# Altium schematic sheet hsi_filters.SchDoc
size A4; PageSetup: Record=PageOptions|CenterHorizontal=True|CenterVertical=True|PrintScale=0.91|XCorrection=1.00|YCorrection=1.00|PrintKind=1|BorderSize=5000000|LeftOffset=0|BottomOffset=0|Orientation=2|PaperLength=1000|PaperWidth=1000|Scale=100|PaperSource=15|PrintQuality=1200|MediaType=1|DitherType=10|PaperKind=Letter|PrintScaleMode=1
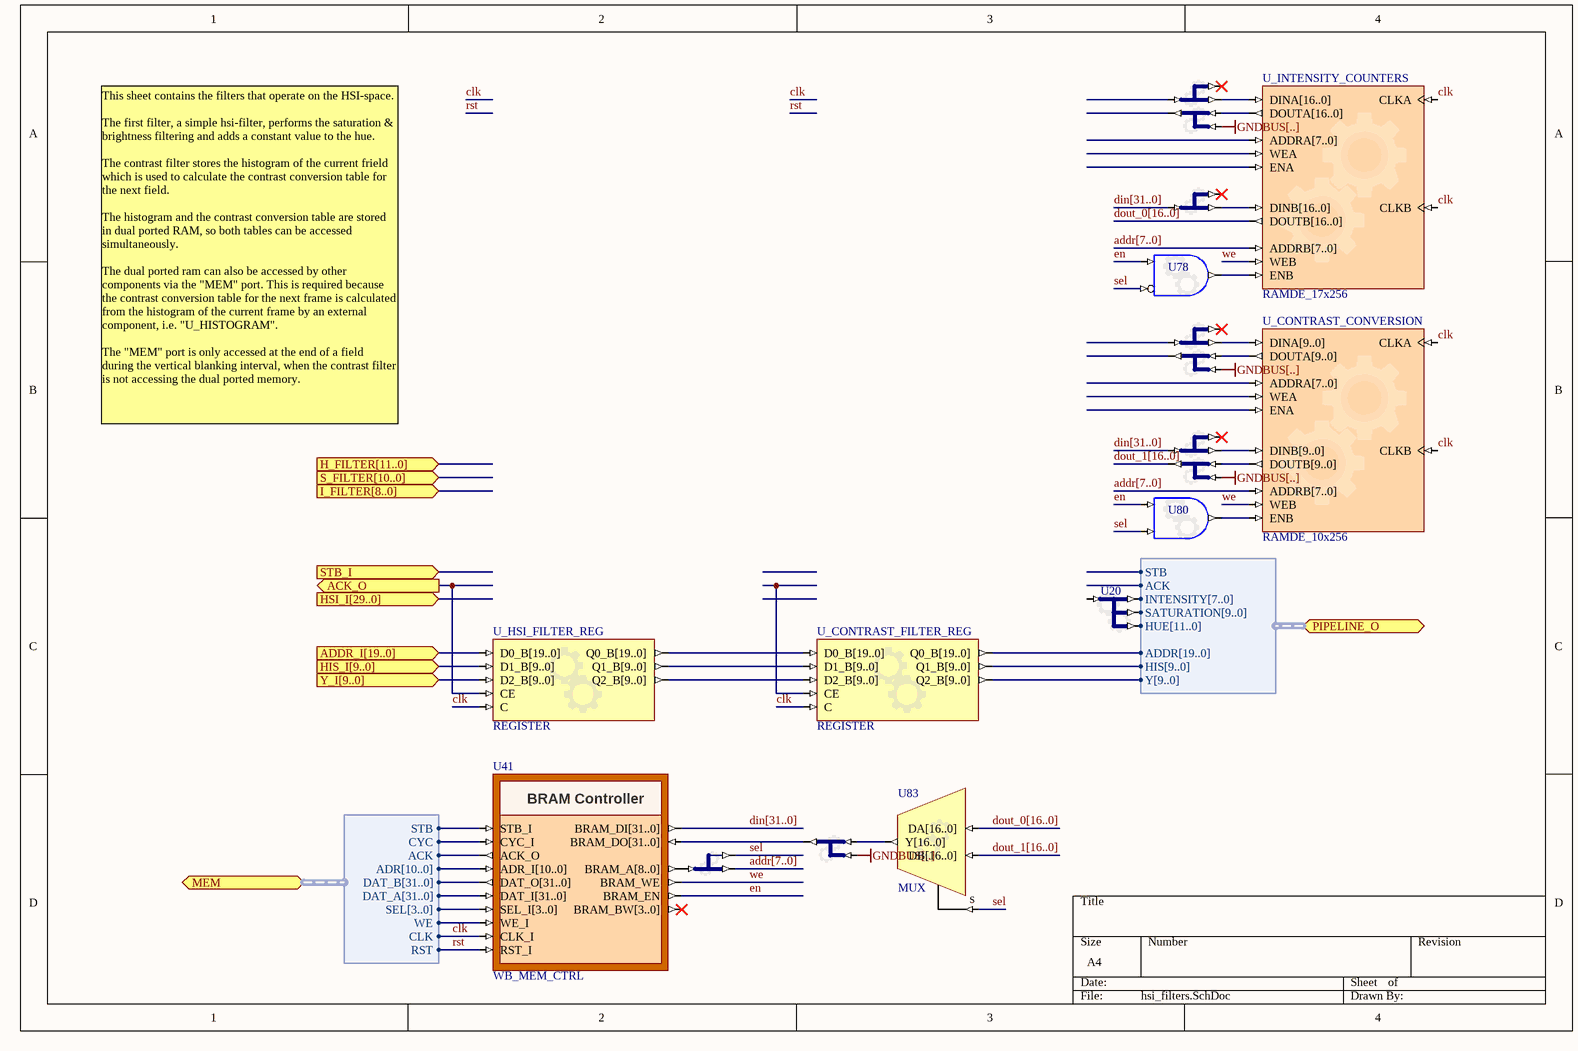
[diagram p0: hsi_filters.SchDoc]

## Parts
U1  BUS_JS  (value not drawn)
U16  BUS_JS  (value not drawn)
U17  BUS_JS  (value not drawn)
U20  BUS_JS  (value not drawn)
U41  WB_MEM_CTRL
U44  BUS_JS  (value not drawn)
U55  BUS_JS  (value not drawn)
U56  BUS_JS  (value not drawn)
U63  BUS_JS  (value not drawn)
U73  BUS_JS  (value not drawn)
U78  AND2S  (value not drawn)
U80  AND2S  (value not drawn)
U81  BUS_JS  (value not drawn)
U83  MUX
U_CONTRAST_CONVERSION  RAMDE_10x256
U_CONTRAST_FILTER_REG  REGISTER
U_HSI_FILTER_REG  REGISTER
U_INTENSITY_COUNTERS  RAMDE_17x256

## Ports
ACK_O (out), ADDR_I[19..0] (in), H_FILTER[11..0] (in), HIS_I[9..0] (in), HSI_I[29..0] (in), I_FILTER[8..0] (in), MEM (harness WB_A11DAB32S), PIPELINE_O (harness H_PIXEL_PIPELINE_1_5), S_FILTER[10..0] (in), STB_I (in), Y_I[9..0] (in)

## Harnesses
WB_A11DAB32S: STB, CYC, ACK, ADR[10..0], DAT_A[31..0], DAT_B[31..0], SEL[3..0], WE, CLK, RST
H_PIXEL_PIPELINE_1_5: ADDR[19..0], Y[9..0], HIS[9..0], STB, ACK, HUE[11..0], SATURATION[9..0], INTENSITY[7..0]

## Nets
GNDBUS[..]: U17.I1_B[14..0] U56.I1_B[14..0] U73.I1_B[5..0] U81.I1_B[6..0]
ACK_O: U_HSI_FILTER_REG.CE ; port ACK_O
addr[7..0]: U44.O0_B[7..0] U_CONTRAST_CONVERSION.ADDRB[7..0] U_INTENSITY_COUNTERS.ADDRB[7..0]
ADDR_I[19..0]: U_HSI_FILTER_REG.D0_B[19..0] ; port ADDR_I[19..0]
clk: U41.CLK_I U_CONTRAST_CONVERSION.CLKA U_CONTRAST_CONVERSION.CLKB U_CONTRAST_FILTER_REG.C U_HSI_FILTER_REG.C U_INTENSITY_COUNTERS.CLKA U_INTENSITY_COUNTERS.CLKB ; port MEM.CLK
din[31..0]: U1.I[31..0] U16.I[31..0] U41.BRAM_DI[31..0]
dout_0[16..0]: U83.DA[16..0] U_INTENSITY_COUNTERS.DOUTB[16..0]
dout_1[16..0]: U81.O[16..0] U83.DB[16..0]
en: U41.BRAM_EN U78.I0 U80.I0
HIS_I[9..0]: U_HSI_FILTER_REG.D1_B[9..0] ; port HIS_I[9..0]
rst: U41.RST_I ; port MEM.RST
sel: U44.O1 U78.I1 U80.I1 U83.S
we: U41.BRAM_WE U_CONTRAST_CONVERSION.WEB U_INTENSITY_COUNTERS.WEB
Y_I[9..0]: U_HSI_FILTER_REG.D2_B[9..0] ; port Y_I[9..0]
NetU1_O0_B[16..0]: U1.O0_B[16..0] U_INTENSITY_COUNTERS.DINB[16..0]
NetU16_O0_B[9..0]: U16.O0_B[9..0] U_CONTRAST_CONVERSION.DINB[9..0]
NetU17_I0_B[16..0]: U17.I0_B[16..0] U83.Y[16..0]
NetU17_O[31..0]: U17.O[31..0] U41.BRAM_DO[31..0]
NetU20_O0_B[7..0]: U20.O0_B[7..0] ; port PIPELINE_O.INTENSITY[7..0]
NetU20_O1_B[9..0]: U20.O1_B[9..0] ; port PIPELINE_O.SATURATION[9..0]
NetU20_O2_B[11..0]: U20.O2_B[11..0] ; port PIPELINE_O.HUE[11..0]
NetU41_ACK_O: U41.ACK_O ; port MEM.ACK
NetU41_ADR_I[10..0]: U41.ADR_I[10..0] ; port MEM.ADR[10..0]
NetU41_BRAM_A[8..0]: U41.BRAM_A[8..0] U44.I[8..0]
NetU41_CYC_I: U41.CYC_I ; port MEM.CYC
NetU41_DAT_I[31..0]: U41.DAT_I[31..0] ; port MEM.DAT_A[31..0]
NetU41_DAT_O[31..0]: U41.DAT_O[31..0] ; port MEM.DAT_B[31..0]
NetU41_SEL_I[3..0]: U41.SEL_I[3..0] ; port MEM.SEL[3..0]
NetU41_STB_I: U41.STB_I ; port MEM.STB
NetU41_WE_I: U41.WE_I ; port MEM.WE
NetU55_O0_B[16..0]: U55.O0_B[16..0] U_INTENSITY_COUNTERS.DINA[16..0]
NetU56_I0_B[16..0]: U56.I0_B[16..0] U_INTENSITY_COUNTERS.DOUTA[16..0]
NetU63_O0_B[9..0]: U63.O0_B[9..0] U_CONTRAST_CONVERSION.DINA[9..0]
NetU73_I0_B[9..0]: U73.I0_B[9..0] U_CONTRAST_CONVERSION.DOUTA[9..0]
NetU78_O: U78.O U_INTENSITY_COUNTERS.ENB
NetU80_O: U80.O U_CONTRAST_CONVERSION.ENB
NetU81_I0_B[9..0]: U81.I0_B[9..0] U_CONTRAST_CONVERSION.DOUTB[9..0]
NetU_CONTRAST_FILTER_REG_D0_B[19..0]: U_CONTRAST_FILTER_REG.D0_B[19..0] U_HSI_FILTER_REG.Q0_B[19..0]
NetU_CONTRAST_FILTER_REG_D1_B[9..0]: U_CONTRAST_FILTER_REG.D1_B[9..0] U_HSI_FILTER_REG.Q1_B[9..0]
NetU_CONTRAST_FILTER_REG_D2_B[9..0]: U_CONTRAST_FILTER_REG.D2_B[9..0] U_HSI_FILTER_REG.Q2_B[9..0]
NetU_CONTRAST_FILTER_REG_Q0_B[19..0]: U_CONTRAST_FILTER_REG.Q0_B[19..0] ; port PIPELINE_O.ADDR[19..0]
NetU_CONTRAST_FILTER_REG_Q1_B[9..0]: U_CONTRAST_FILTER_REG.Q1_B[9..0] ; port PIPELINE_O.HIS[9..0]
NetU_CONTRAST_FILTER_REG_Q2_B[9..0]: U_CONTRAST_FILTER_REG.Q2_B[9..0] ; port PIPELINE_O.Y[9..0]

Not connected (* = marked no-connect by the designer): U1 O1_B[14..0]*; U16 O1_B[21..0]*; U20 I[29..0]; U41 BRAM_BW[3..0]*; U55 I[31..0] O1_B[14..0]*; U56 O[31..0]; U63 I[15..0] O1_B[5..0]*; U73 O[15..0]; U_CONTRAST_CONVERSION ADDRA[7..0] ENA WEA; U_CONTRAST_FILTER_REG CE; U_INTENSITY_COUNTERS ADDRA[7..0] ENA WEA

## Buses and harness runs
bus addr[7..0]
bus din[31..0]
bus dout_0[16..0]
bus dout_1[16..0]

## Notes on the sheet
- This sheet contains the filters that operate on the HSI-space.
  The first filter, a simple hsi-filter, performs the saturation & brightness filtering and adds a constant value to the hue.
  The contrast filter stores the histogram of the current frield which is used to calculate the contrast conversion table for the next field.
  The histogram and the contrast conversion table are stored in dual ported RAM, so both tables can be accessed simultaneously.
  The dual ported ram can also be accessed by other components via the "MEM" port. This is required because the contrast conversion table for the next frame is calculated from the histogram of the current frame by an external component, i.e. "U_HISTOGRAM".
  The "MEM" port is only accessed at the end of a field during the vertical blanking interval, when the contrast filter is not accessing the dual ported memory.
- (in symbol WB_MEM_CTRL) BRAM Controller

## Library data of the parts
U1 U55 = BUS_JS: Configurable Bus Joiner/Splitter; ConfiguratorName: GENERIC_BUS_JS; ConfigurationParameters: {}Version[1.1]{}SplitterJoinerType[Splitter]{}SignalCount[2]{}SignalWidth0[17]{}GapBelow0[1000000]{}ConnectionType0[Pin]{}SignalWidth1[15]{}GapBelow1[1000000]{}ConnectionType1[Pin]{}ShowPinNames[False]{}; LastRevisionNo: 1.00.00; Published: 17-Sep-2008; Publisher: Altium Limited; HelpURL: https://wiki.altium.com/display/ADOH/Configurable+Generic+Library
U16 = BUS_JS: Configurable Bus Joiner/Splitter; ConfiguratorName: GENERIC_BUS_JS; ConfigurationParameters: {}Version[1.1]{}SplitterJoinerType[Splitter]{}SignalCount[2]{}SignalWidth0[10]{}GapBelow0[1000000]{}ConnectionType0[Pin]{}SignalWidth1[22]{}GapBelow1[1000000]{}ConnectionType1[Pin]{}ShowPinNames[False]{}; LastRevisionNo: 1.00.00; Published: 17-Sep-2008; Publisher: Altium Limited; HelpURL: https://wiki.altium.com/display/ADOH/Configurable+Generic+Library
U17 U56 = BUS_JS: Configurable Bus Joiner/Splitter; ConfiguratorName: GENERIC_BUS_JS; ConfigurationParameters: {}Version[1.1]{}SplitterJoinerType[Joiner]{}SignalCount[2]{}SignalWidth0[17]{}GapBelow0[1000000]{}ConnectionType0[Pin]{}SignalWidth1[15]{}GapBelow1[1000000]{}ConnectionType1[Pin]{}ShowPinNames[False]{}; LastRevisionNo: 1.00.00; Published: 17-Sep-2008; Publisher: Altium Limited; HelpURL: https://wiki.altium.com/display/ADOH/Configurable+Generic+Library
U20 = BUS_JS: Configurable Bus Joiner/Splitter; ConfiguratorName: GENERIC_BUS_JS; ConfigurationParameters: {}Version[1.1]{}SplitterJoinerType[Splitter]{}SignalCount[3]{}SignalWidth0[8]{}GapBelow0[1000000]{}ConnectionType0[Pin]{}SignalWidth1[10]{}GapBelow1[1000000]{}ConnectionType1[Pin]{}SignalWidth2[12]{}GapBelow2[1000000]{}ConnectionType2[Pin]{}ShowPinNames[False]{}; LastRevisionNo: 1.00.00; Published: 17-Sep-2008; Publisher: Altium Limited; HelpURL: https://wiki.altium.com/display/ADOH/Configurable+Generic+Library
U41 = WB_MEM_CTRL: Configurable Memory Controller; ConfigurationParameters: {}Version[1.0]{}Option_MemoryType[Block RAM]{}Option_MemorySize[2 KB (512 x 32-bit)]{}Option_Layout[1 x 32-bit Wide Device]{}Option_Read[2]{}Option_WriteSetup[1]{}Option_WritePulse[1]{}Option_WriteHold[1]{}Option_FlashRead[4]{}Option_FlashWriteSetup[1]{}Option_FlashWritePulse[5]{}Option_FlashWriteHold[1]{}Option_SdramKeepRowOpen[0]{}Option_SdramClock[100]{}Option_SdramWriteRecovery[4]{}Option_SdramAutoRefresh[16]{}Option_SdramActiveToReadWrite[8]{}Option_SdramPrecharge[16]{}Option_SdramCasLatency[2]{}Option_SdramClockScheme[0]{}; UseInDSF: True; ComponentLink1Description: Core &Resource Usage; ComponentLink1URL: CR0139 FPGA Peripheral Resource Usage.pdf#page=85; HelpURL: https://wiki.altium.com/display/ADOH/WB_MEM_CTRL+-+Configurable+Wishbone+Memory+Controller; LastRevisionNo: 1.00.00; Published: 9-Dec-2004; Publisher: Altium Limited; ConfiguratorName: WB_MEM_CTRL
U44 = BUS_JS: Configurable Bus Joiner/Splitter; ConfiguratorName: GENERIC_BUS_JS; ConfigurationParameters: {}Version[1.1]{}SplitterJoinerType[Splitter]{}SignalCount[2]{}SignalWidth0[8]{}GapBelow0[1000000]{}ConnectionType0[Pin]{}SignalWidth1[1]{}GapBelow1[1000000]{}ConnectionType1[Pin]{}ShowPinNames[False]{}; LastRevisionNo: 1.00.00; Published: 17-Sep-2008; Publisher: Altium Limited; HelpURL: https://wiki.altium.com/display/ADOH/Configurable+Generic+Library
U63 = BUS_JS: Configurable Bus Joiner/Splitter; ConfiguratorName: GENERIC_BUS_JS; ConfigurationParameters: {}Version[1.1]{}SplitterJoinerType[Splitter]{}SignalCount[2]{}SignalWidth0[10]{}GapBelow0[1000000]{}ConnectionType0[Pin]{}SignalWidth1[6]{}GapBelow1[1000000]{}ConnectionType1[Pin]{}ShowPinNames[False]{}; LastRevisionNo: 1.00.00; Published: 17-Sep-2008; Publisher: Altium Limited; HelpURL: https://wiki.altium.com/display/ADOH/Configurable+Generic+Library
U73 = BUS_JS: Configurable Bus Joiner/Splitter; ConfiguratorName: GENERIC_BUS_JS; ConfigurationParameters: {}Version[1.1]{}SplitterJoinerType[Joiner]{}SignalCount[2]{}SignalWidth0[10]{}GapBelow0[1000000]{}ConnectionType0[Pin]{}SignalWidth1[6]{}GapBelow1[1000000]{}ConnectionType1[Pin]{}ShowPinNames[False]{}; LastRevisionNo: 1.00.00; Published: 17-Sep-2008; Publisher: Altium Limited; HelpURL: https://wiki.altium.com/display/ADOH/Configurable+Generic+Library
U78 = GATE: Configurable Generic Gate; ConfiguratorName: GENERIC_GATE; ConfigurationParameters: {}Version[1.1]{}GateKind[AND]{}BusInput[False]{}GateInputType[Bit]{}GateOutputOption[Normal]{}BusWidth[8]{}RegisterOutputs[False]{}NegativeClockEdge[False]{}InputCount[2]{}InputInvert0[False]{}InputInvert1[True]{}; LastRevisionNo: 1.00.00; Published: 3-Sep-2008; Publisher: Altium Limited; HelpURL: https://wiki.altium.com/display/ADOH/Configurable+Generic+Library
U80 = GATE: Configurable Generic Gate; ConfiguratorName: GENERIC_GATE; ConfigurationParameters: {}Version[1.1]{}GateKind[AND]{}BusInput[False]{}GateInputType[Bit]{}GateOutputOption[Normal]{}BusWidth[8]{}RegisterOutputs[False]{}NegativeClockEdge[False]{}InputCount[2]{}InputInvert0[False]{}InputInvert1[False]{}; LastRevisionNo: 1.00.00; Published: 3-Sep-2008; Publisher: Altium Limited; HelpURL: https://wiki.altium.com/display/ADOH/Configurable+Generic+Library
U81 = BUS_JS: Configurable Bus Joiner/Splitter; ConfiguratorName: GENERIC_BUS_JS; ConfigurationParameters: {}Version[1.1]{}SplitterJoinerType[Joiner]{}SignalCount[2]{}SignalWidth0[10]{}GapBelow0[1000000]{}ConnectionType0[Pin]{}SignalWidth1[7]{}GapBelow1[1000000]{}ConnectionType1[Pin]{}ShowPinNames[False]{}; LastRevisionNo: 1.00.00; Published: 17-Sep-2008; Publisher: Altium Limited; HelpURL: https://wiki.altium.com/display/ADOH/Configurable+Generic+Library
U83 = MUX: Configurable Mutliplexer; ConfigurationParameters: {}Version[1.0]{}ShowEnable[False]{}BusInputs[True]{}BusOutputs[True]{}SignalWidth[17]{}Type[Multiplexer]{}RegisterOutputs[False]{}NegativeClockEdge[False]{}ShowPinNames[True]{}InvertSingleSignal[False]{}SignalCount[2]{}Invert0[False]{}Invert1[False]{}; ConfiguratorName: GENERIC_MULTIPLEXER; LastRevisionNo: 1.00.00; Published: 31-Dec-2008; Publisher: Altium Limited
U_CONTRAST_CONVERSION = MEMORY: Configurable Memory; ConfiguratorName: GENERIC_MEMORY; ConfigurationParameters: {}Version[1.0]{}Option_MemoryDepthText[256]{}Option_MemoryWidth[10]{}Option_PortCount[1]{}Option_MemoryType[0]{}Option_ByteWrites[False]{}Option_RisingEdgeClock[True]{}Option_EnablePin[True]{}Option_ResetPin[False]{}Option_UseDistributed[False]{}Option_InitMemoryFlag[False]{}Option_MemoryFileName[ ]{}; LastRevisionNo: 1.00.00; Published: 28-Oct-2008; Publisher: Altium Limited; HelpURL: https://wiki.altium.com/display/ADOH/Configurable+Generic+Library
U_CONTRAST_FILTER_REG U_HSI_FILTER_REG = REGISTER: Configurable Register; ConfiguratorName: GENERIC_REGISTER; ConfigurationParameters: {}Version[1.1]{}RegisterType[DFlipFlop]{}NegativeTrigger[False]{}TriggerEnable[True]{}ResetMode[None]{}SetMode[None]{}SignalCount[3]{}SignalWidth0[20]{}OutputOption0[Normal]{}SignalWidth1[10]{}OutputOption1[Normal]{}SignalWidth2[10]{}OutputOption2[Normal]{}; LastRevisionNo: 1.00.00; Published: 13-Oct-2008; Publisher: Altium Limited; HelpURL: https://wiki.altium.com/display/ADOH/Configurable+Generic+Library
U_INTENSITY_COUNTERS = MEMORY: Configurable Memory; ConfiguratorName: GENERIC_MEMORY; ConfigurationParameters: {}Version[1.0]{}Option_MemoryDepthText[256]{}Option_MemoryWidth[17]{}Option_PortCount[1]{}Option_MemoryType[0]{}Option_ByteWrites[False]{}Option_RisingEdgeClock[True]{}Option_EnablePin[True]{}Option_ResetPin[False]{}Option_UseDistributed[False]{}Option_InitMemoryFlag[False]{}Option_MemoryFileName[ ]{}; LastRevisionNo: 1.00.00; Published: 28-Oct-2008; Publisher: Altium Limited; HelpURL: https://wiki.altium.com/display/ADOH/Configurable+Generic+Library